# EAGLE design buslamp-r2 (EAGLE 6.4)
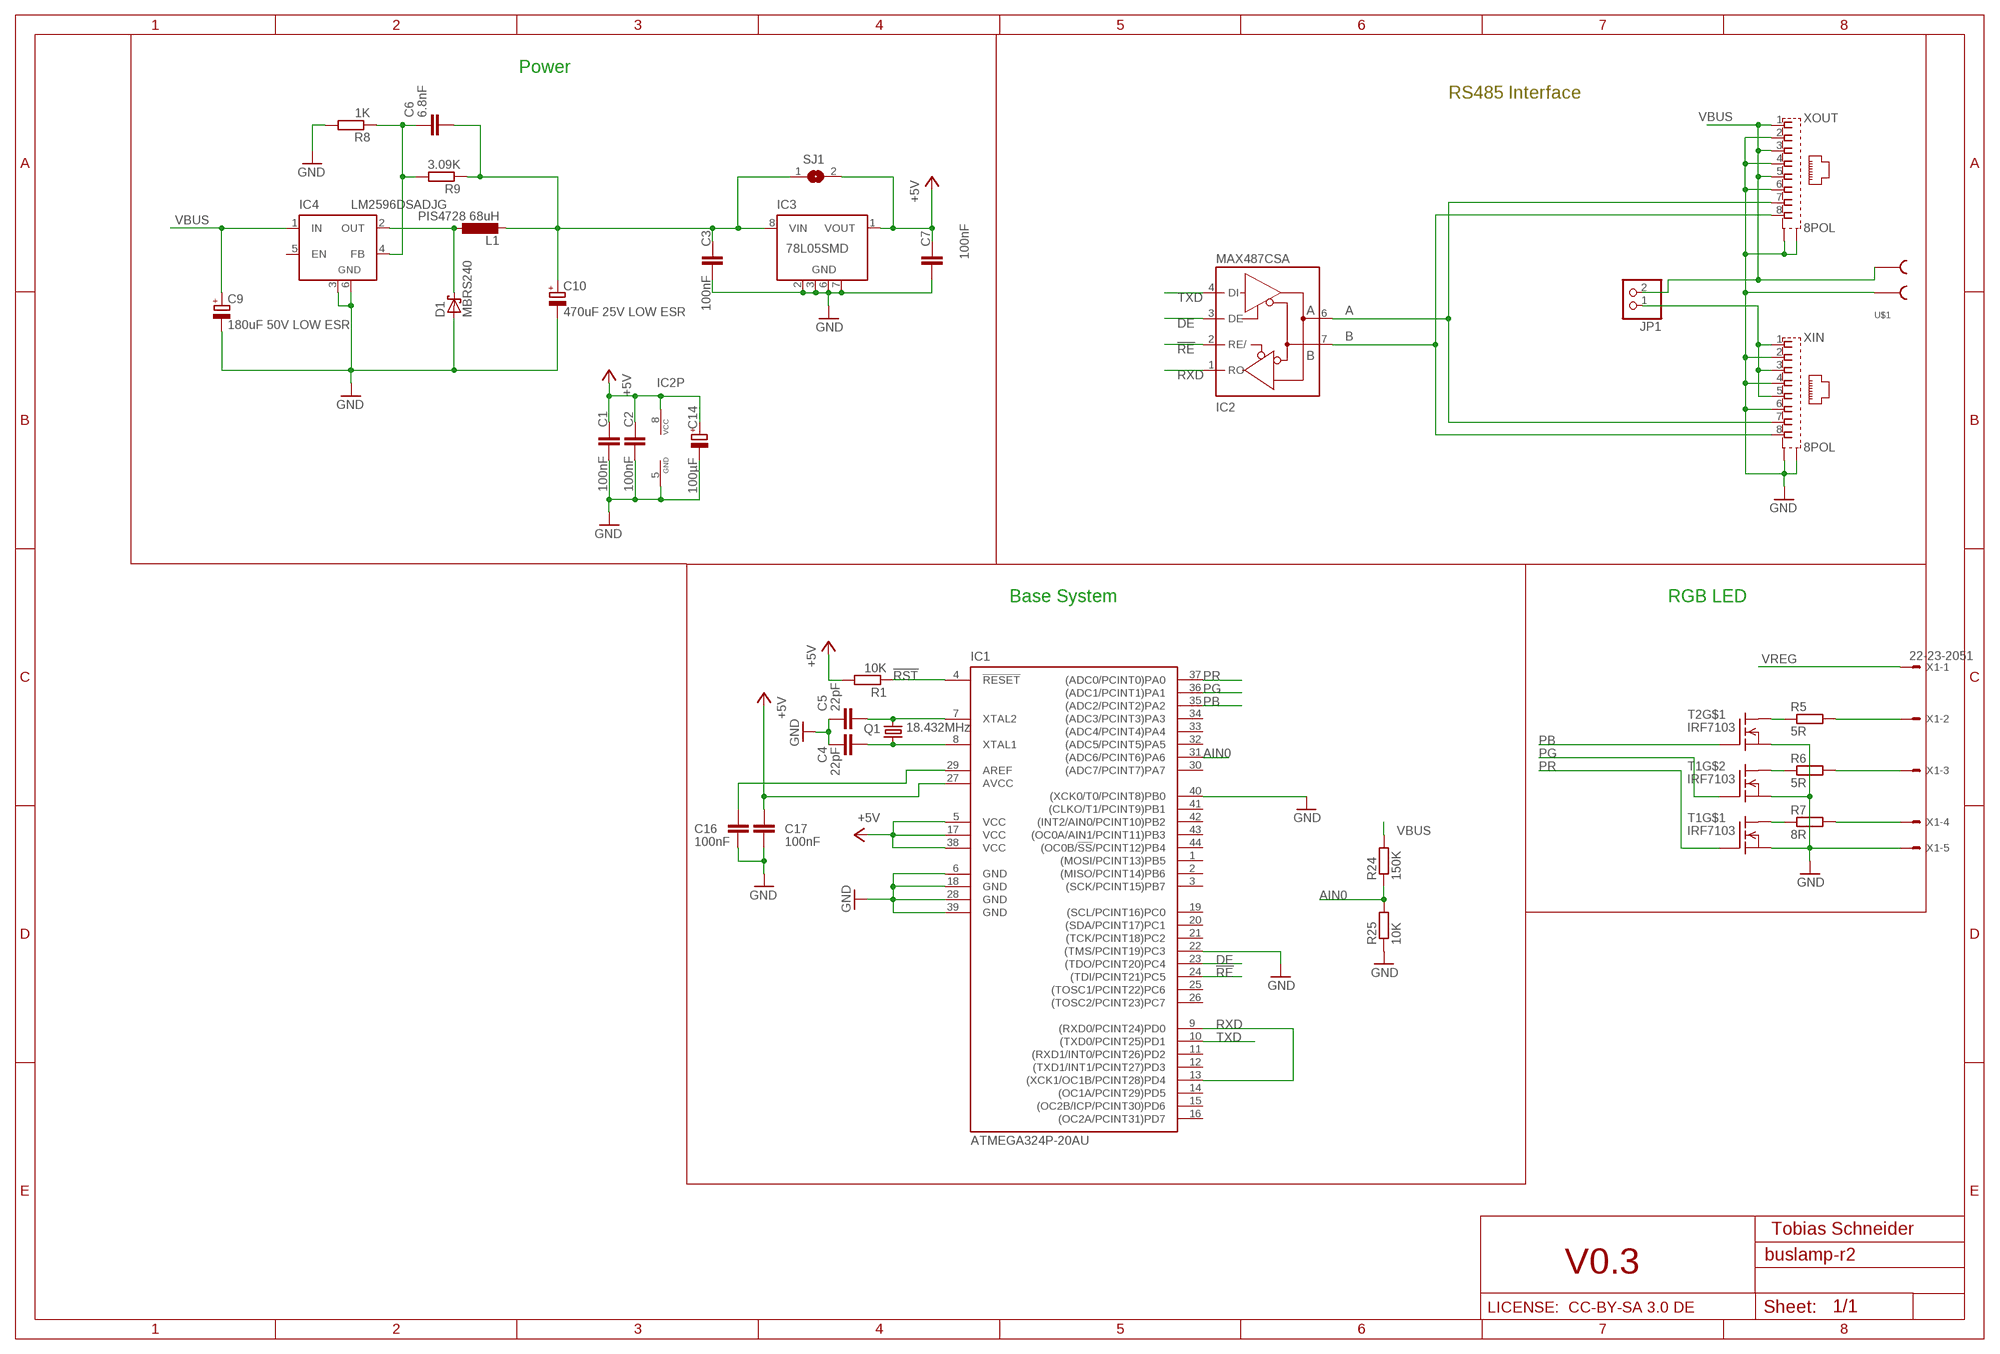
[diagram p0: schematic, sheet 1]

## Parts
C1  100nF  C-EUC0805K  [C0805K]
C2  100nF  C-EUC0805K  [C0805K]
C3  100nF  C-EUC0805K  [C0805K]
C4  22pF  C-EUC0805K  [C0805K]
C5  22pF  C-EUC0805K  [C0805K]
C6  6.8nF  C-EUC0805K  [C0805K]
C7  100nF  C-EUC0805K  [C0805K]
C9  180uF 50V LOW ESR  CPOL-EUE3.5-8  [E3,5-8]
C10  470uF 25V LOW ESR  CPOL-EUE2.5-7  [E2,5-7]
C14  100µF  CPOL-EUE2.5-6  [E2,5-6]
C16  100nF  C-EUC0805  [C0805]
C17  100nF  C-EUC0805  [C0805]
D1  MBRS240  MBRS130LT3  [SMB]
IC1  ATMEGA324P-20AU  MEGA164P/324P/644P-AU  [TQFP44]
IC2  MAX487CSA  MAX481CSA  [SO08]
IC3  78L05SMD  [SO08]
IC4  LM2596DSADJG  LM2596S  [TO263-5]
JP1  PINHD-1X2  [1X02]
L1  PIS4728 68uH  PSI4728  [PIS4728]
Q1  18.432MHz  CRYTALHC49S  [HC49/S]
R1  10K  R-EU_M0805  [M0805]
R5  5R  R-EU_0617/17  [0617/17]
R6  5R  R-EU_0617/17  [0617/17]
R7  8R  R-EU_0617/17  [0617/17]
R8  1K  R-EU_M0805  [M0805]
R9  3.09K  R-EU_M0805  [M0805]
R24  150K  R-EU_R0805  [R0805]
R25  10K  R-EU_R0805  [R0805]
SJ1  SJ  [SJ]
T1  IRF7103  [SO-8]
T2  IRF7103  [SO-8]
U$1  STL-266-2  [STL-266-2]
X1  22-23-2051  [22-23-2051]
XIN  8POL  [8POL]
XOUT  8POL  [8POL]

## Nets
!RE: IC1.24((TDI/PCINT21)PC5) IC2.2(RE/)
!RST: IC1.4(!RESET) R1.1
+5V: C1.1 C2.1 C7.1 C14.+ C17.2 IC1.5(VCC) IC1.17(VCC) IC1.27(AVCC) IC1.38(VCC) IC2.8(VCC) IC3.1(VOUT) R1.2 SJ1.2
A: IC2.6(A) XIN.7 XOUT.7
AIN0: IC1.31((ADC6/PCINT6)PA6) R24.1 R25.2
B: IC2.7(B) XIN.8 XOUT.8
DE: IC1.23((TDO/PCINT20)PC4) IC2.3(DE)
GND: C1.2 C2.2 C3.2 C4.1 C5.1 C7.2 C9.- C10.- C14.- C16.1 C17.1 D1.A IC1.6(GND) IC1.18(GND) IC1.22((TMS/PCINT19)PC3) IC1.28(GND) IC1.39(GND) IC1.40((XCK0/T0/PCINT8)PB0) IC2.5(GND) IC3.2(GND) IC3.3(GND) IC3.6(GND) IC3.7(GND) IC4.3(GND) IC4.6(GND) R8.2 R25.1 T1.1(S) T1.3(S) T2.1(S) U$1.P$3 X1.5 XIN.2 XIN.4 XIN.6 XIN.S1 XIN.S2 XOUT.2 XOUT.4 XOUT.6 XOUT.S1 XOUT.S2
N$1: R7.1 T1.8(D1)
N$3: C6.1 IC4.4(FB) R8.1 R9.2
N$4: R6.1 T1.5(D1)
N$5: R5.1 T2.8(D1)
N$7: R7.2 X1.4
N$8: R6.2 X1.3
N$9: R5.2 X1.2
N$10: D1.C IC4.2(OUT) L1.1
N$29: C16.2 IC1.29(AREF)
PB: IC1.35((ADC2/PCINT2)PA2) T2.2(G)
PG: IC1.36((ADC1/PCINT1)PA1) T1.4(G)
PR: IC1.37((ADC0/PCINT0)PA0) T1.2(G)
RXD: IC1.9((RXD0/PCINT24)PD0) IC1.13((XCK1/OC1B/PCINT28)PD4) IC2.1(RO)
TXD: IC1.10((TXD0/PCINT25)PD1) IC2.4(DI)
VBUS: C9.+ IC4.1(IN) JP1.2 R24.2 U$1.P$4 XOUT.1 XOUT.3 XOUT.5
VBUSOUT: JP1.1 XIN.1 XIN.3 XIN.5
VREG: C3.1 C6.2 C10.+ IC3.8(VIN) L1.2 R9.1 SJ1.1 X1.1
XTAL1: C5.2 IC1.7(XTAL2) Q1.2
XTAL2: C4.2 IC1.8(XTAL1) Q1.1
Unconnected: IC1.1((MOSI/PCINT13)PB5) IC1.2((MISO/PCINT14)PB6) IC1.3((SCK/PCINT15)PB7) IC1.11((RXD1/INT0/PCINT26)PD2) IC1.12((TXD1/INT1/PCINT27)PD3) IC1.14((OC1A/PCINT29)PD5) IC1.15((OC2B/ICP/PCINT30)PD6) IC1.16((OC2A/PCINT31)PD7) IC1.19((SCL/PCINT16)PC0) IC1.20((SDA/PCINT17)PC1) IC1.21((TCK/PCINT18)PC2) IC1.25((TOSC1/PCINT22)PC6) IC1.26((TOSC2/PCINT23)PC7) IC1.30((ADC7/PCINT7)PA7) IC1.32((ADC5/PCINT5)PA5) IC1.33((ADC4/PCINT4)PA4) IC1.34((ADC3/PCINT3)PA3) IC1.41((CLKO/T1/PCINT9)PB1) IC1.42((INT2/AIN0/PCINT10)PB2) IC1.43((OC0A/AIN1/PCINT11)PB3) IC1.44((OC0B/!SS!/PCINT12)PB4) IC3.4(NC) IC3.5(NC) IC4.5(EN) T1.6(D) T1.7(D) T2.3(S) T2.4(G) T2.5(D1) T2.6(D) T2.7(D)

## Notes on the sheet
- Power
- RS485 Interface
- Base System | RGB LED
- Tobias Schneider
- V0.3
- LICENSE:  CC-BY-SA 3.0 DE

## Library data of the parts
C1-C7 C16 C17 = rcl:C-EU: CAPACITOR, European symbol
C9 C10 C14 = rcl:CPOL-EU: POLARIZED CAPACITOR, European symbol
D1 = diode:MBRS130LT3: Schottky Power Rectifier Source: http://www.onsemi.com/pub/Collateral/MBRS130LT3-D.PDF
IC1 = avr-5:MEGA164P/324P/644P-AU
IC2 = maxim:MAX481CSA: RS485 TRANSEIVER
IC3 = linear:78L*SMD: Positive VOLTAGE REGULATOR
IC4 = linear:LM2596S: STEP-DOWN VOLTAGE REGULATOR
JP1 = pinhead:PINHD-1X2: PIN HEADER
L1 = rcl:PSI4728
Q1 = crystal:CRYTAL: CRYSTAL
R1 R8 R9 R24 R25 = rcl:R-EU_: RESISTOR, European symbol
R5-R7 = rclml:R-EU_: RESISTOR, European symbol
SJ1 = jumper:SJ: SMD solder JUMPER
T1 T2 = transistor-fet+irf7201:IRF7103
U$1 = xtort:STL-266-2
X1 = con-molex:22-23-2051: .100" (2.54mm) Center Header - 5 Pin; MF: MOLEX; MPN: 22-23-2051; OC_FARNELL: 1462952; OC_NEWARK: 38C9178
XIN XOUT = con-amp:8POL

## Board
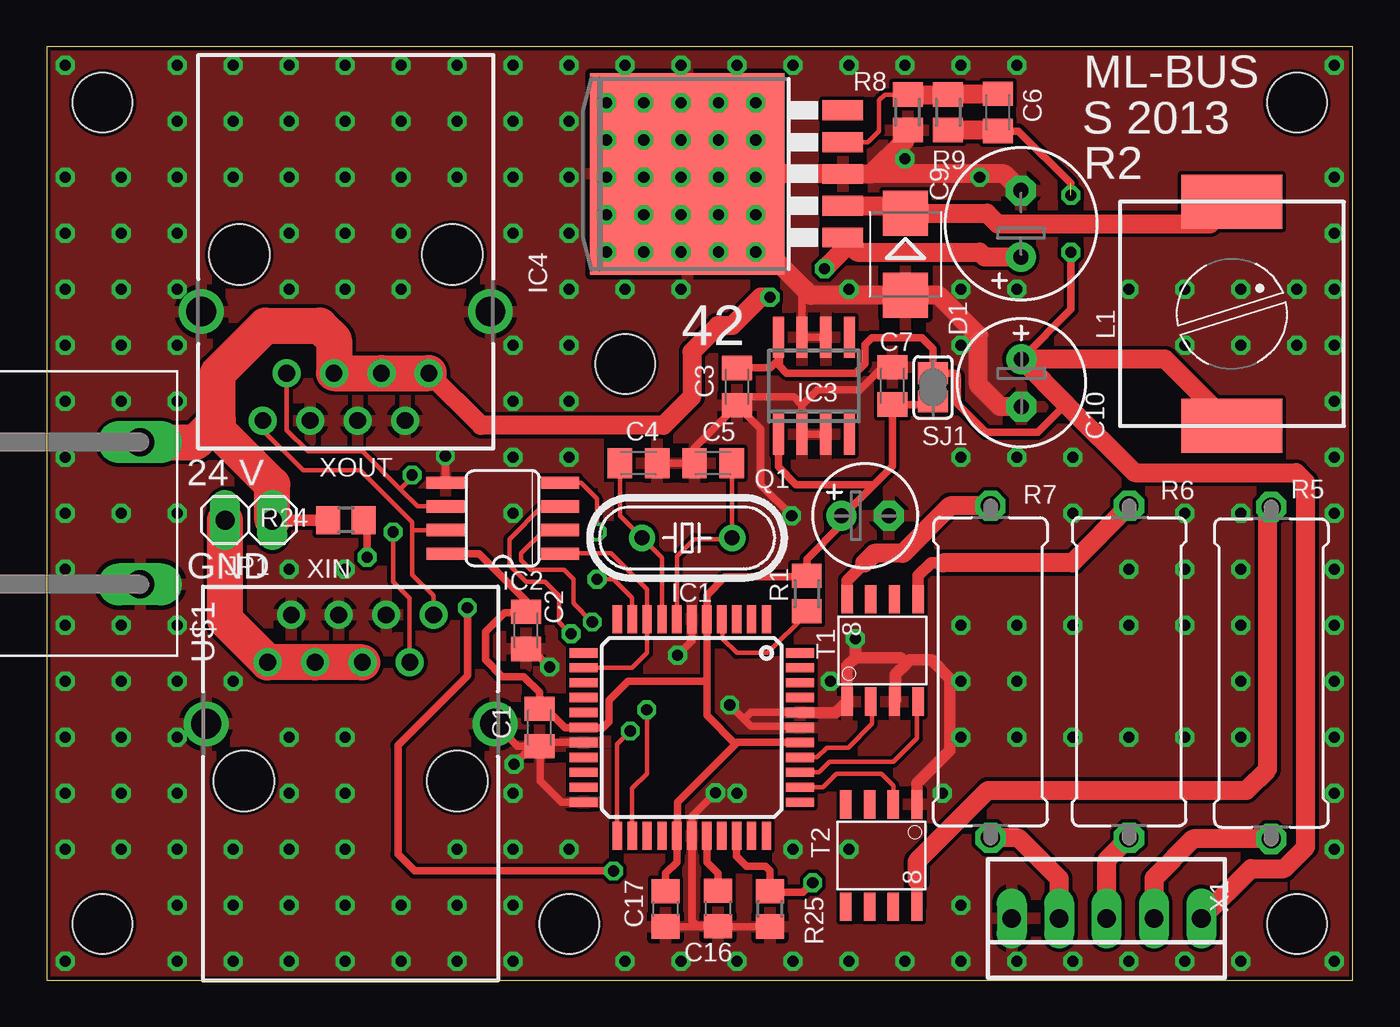
[diagram p1: board, top side]
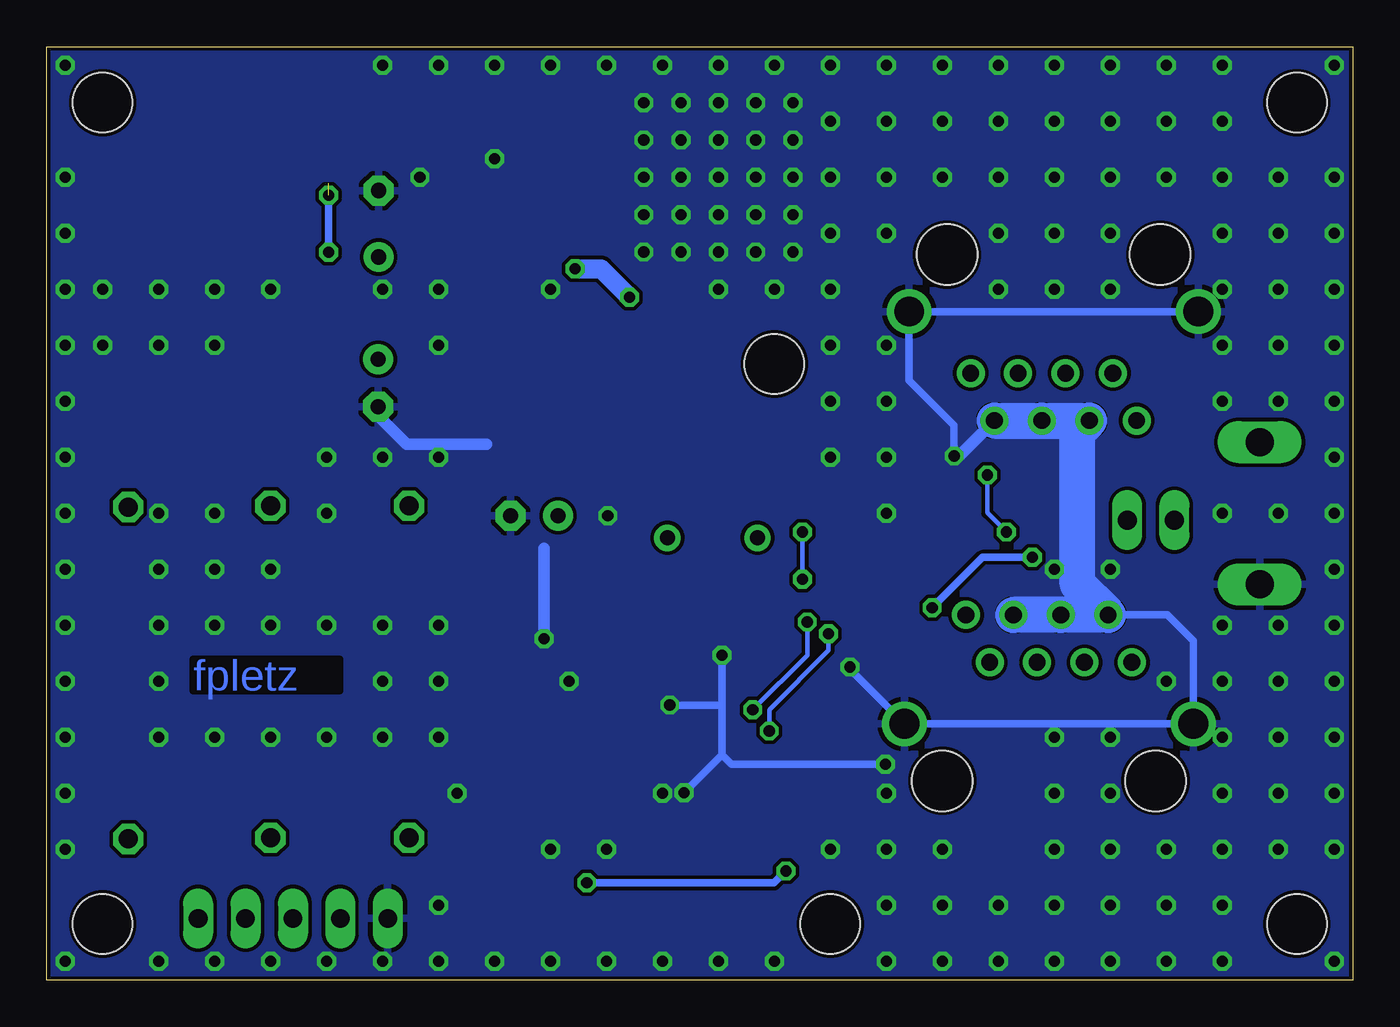
[diagram p2: board, bottom side, seen from below]

Size 70 x 50 mm. Coordinates in mm from the lower left corner, seen from the top.
Outline: 0,0 70,0 70,50 0,50 0,0
Copper layers (1*16): Top 0.035mm / dielectric 1.5mm / Bottom 0.035mm
Design rules "default *": minimum track width 0.2mm, minimum drill 0.5mm, track to track 0.2mm, track to pad 0.2mm, pad to pad 0.2mm, via to via 0.2mm, smd to smd 0mil, copper to edge 0.2mm, drill to drill 8mil, minimum pad ring 0.3mm, minimum via ring 8mil, stop-mask expansion 4mil, vias tented up to drill 0mil, thermal gap 10mil
Holes 3.2 mm at 67,47 67,3 28,3 31,33 3,3 3,47
tRestrict: area 29.7,21 to 29.7,22.4; 3 lines

### Footprints (pad centres in the part's own frame; a part is rotated, then mirrored left to right if it is on the bottom)
C0805K = smd 1.3 x 1.6: 1 -1,0; 2 1,0
E3,5-8 = drill 0.813 pad 1.6: + -1.778,0 | drill 0.813 pad 1.6 octagon: - 1.778,0
E2,5-7 = drill 0.813 pad 1.6: + -1.27,0 | drill 0.813 pad 1.6 octagon: - 1.27,0
E2,5-6 = drill 0.813 pad 1.6: + -1.27,0 | drill 0.813 pad 1.6 octagon: - 1.27,0
C0805 = smd 1.3 x 1.5: 1 -0.95,0; 2 0.95,0
SMB = smd 2.4 x 2.4: A 2.2,0; C -2.2,0
TQFP44 = smd 1.5 x 0.5: 1 -5.8,4; 2 -5.8,3.2; 3 -5.8,2.4; 4 -5.8,1.6; 5 -5.8,0.8; 6 -5.8,0; 7 -5.8,-0.8; 8 -5.8,-1.6; 9 -5.8,-2.4; 10 -5.8,-3.2; 11 -5.8,-4; 23 5.8,-4; 24 5.8,-3.2; 25 5.8,-2.4; 26 5.8,-1.6; 27 5.8,-0.8; 28 5.8,0; 29 5.8,0.8; 30 5.8,1.6; 31 5.8,2.4; 32 5.8,3.2; 33 5.8,4 | smd 0.5 x 1.5: 12 -4,-5.8; 13 -3.2,-5.8; 14 -2.4,-5.8; 15 -1.6,-5.8; 16 -0.8,-5.8; 17 0,-5.8; 18 0.8,-5.8; 19 1.6,-5.8; 20 2.4,-5.8; 21 3.2,-5.8; 22 4,-5.8; 34 4,5.8; 35 3.2,5.8; 36 2.4,5.8; 37 1.6,5.8; 38 0.8,5.8; 39 0,5.8; 40 -0.8,5.8; 41 -1.6,5.8; 42 -2.4,5.8; 43 -3.2,5.8; 44 -4,5.8
SO08 = smd 0.66 x 2.032: 1 -1.905,-3.073; 2 -0.635,-3.073; 3 0.635,-3.073; 4 1.905,-3.073; 5 1.905,3.073; 6 0.635,3.073; 7 -0.635,3.073; 8 -1.905,3.073
SO08' = smd 0.6 x 2.2: 1 -1.905,-2.6; 2 -0.635,-2.6; 3 0.635,-2.6; 4 1.905,-2.6; 5 1.905,2.6; 6 0.635,2.6; 7 -0.635,2.6; 8 -1.905,2.6
TO263-5 = smd 1.067 x 2.159: 1 -3.404,-5.791; 2 -1.702,-5.791; 3 0,-5.791; 4 1.702,-5.791; 5 3.404,-5.791 | smd 10.8 x 10.41: 6 0,2.54
1X02 = drill 1.016 long: 1 -1.27,0; 2 1.27,0
PIS4728 = smd 5.4 x 2.9: 1 0,6; 2 0,-6
HC49/S = drill 0.813: 1 -2.413,0; 2 2.413,0
M0805 = smd 1.3 x 1.6: 1 -0.95,0; 2 0.95,0
0617/17 = drill 1.016 octagon: 1 -8.89,0; 2 8.89,0
R0805 = smd 1.3 x 1.5: 1 -0.95,0; 2 0.95,0
SJ = smd 1.168 x 1.6: 1 -0.762,0; 2 0.762,0
SO-8 = smd 1.524 x 0.61: 1 -2.743,1.27; 2 -2.743,0; 3 -2.743,-1.27; 4 -2.743,-2.54; 5 2.743,-2.54; 6 2.743,-1.27; 7 2.743,0; 8 2.743,1.27
STL-266-2 = drill 1.5 long: P$3 -3.81,-4; P$4 3.81,-4
22-23-2051 = drill 1 long: 1 -5.08,0; 2 -2.54,0; 3 0,0; 4 2.54,0; 5 5.08,0
8POL = drill 0.9: 1 -4.445,6.35; 2 -3.175,8.89; 3 -1.905,6.35; 4 -0.635,8.89; 5 0.635,6.35; 6 1.905,8.89; 7 3.175,6.35; 8 4.445,8.89 | drill 1.6: S1 -7.745,3.05; S2 7.745,3.05 | hole 3.25: -5.715,0; 5.715,0

### Placement (x,y rotation side)
C1  26.41,13.53 270 top
C2  25.68,18.73 270 top
C3  36.99,31.79 270 top
C4  31.72,27.69 180 top
C5  35.72,27.69 0 top
C6  50.97,46.48 270 top
C7  45.32,31.83 90 top
C9  52.21,40.51 90 top
C10  52.23,31.99 270 top
C14  43.87,24.87 0 top
C16  35.99,3.83 90 top
C17  33.18,3.81 90 top
D1  46.02,38.88 270 top
IC1  34.58,13.53 270 top
IC2  24.44,24.74 90 top
IC3  78L05SMD  [SO08']  41.12,31.83 0 top
IC4  36.88,43.18 90 top
JP1  10.83,24.64 0 top
L1  63.52,35.69 0 top
Q1  34.32,23.69 0 top
R1  40.73,20.7 90 top
R5  65.63,16.45 270 top
R6  58.01,16.51 270 top
R7  50.58,16.51 270 top
R8  46.15,46.48 270 top
R9  48.31,46.48 90 top
R24  16.03,24.64 180 top
R25  38.77,3.81 90 top
SJ1  47.5,31.75 270 top
T1  44.16,17.65 90 top
T2  45.37,6.67 270 top
U$1  1,25 90 top
X1  56.8,3.3 180 top
XIN  16.29,10.67 0 top
XOUT  16.03,38.86 180 top

### Tracks (layer width: path | path; a pad name or v marks a point on that pad's centre or on a via)
!RE  (via drill 0.6)
  Top 0.254: IC2.2 26.67,24.1 25.43,22.86 25.43,22.48 25.94,21.97 27.72,21.97 28.23,21.46 28.23,20.19 v29.24,19.18 | v32.16,14.48 32.16,11.05 31.38,10.26 IC1.24
  Bottom 0.254: v29.24,19.18 29.24,17.4 v32.16,14.48
!RST
  Top 0.254: R1.1 40.73,19.62 38.64,17.53 36.99,17.53 36.23,18.29 36.23,19.27 IC1.4
+5V
  Top 0.406: IC1.38 37.01,12.73 36.92,12.64 | 36.92,12.64 33.81,9.53 33.81,7.76 IC1.27 33.77,6.31 33.18,5.71 C17.2 | 36.92,12.64 35.38,14.19 35.38,15.88 | 35.38,15.88 IC1.5 35.38,20.61 36.35,21.59 40.67,21.59 R1.2 40.73,22.54 42.6,24.41 C14.+ 42.68,24.87 44.29,26.48 | 44.29,26.48 44.23,26.54 40.16,26.54 39.21,27.5 IC3.1 | 44.29,26.48 45.32,27.51 C7.1 47.34,30.83 SJ1.2 | 35.38,15.88 35.25,16 31.15,16 30.13,14.99 30.13,13.84 29.81,13.53 IC1.17 27.78,13.53 26.95,14.35 26.58,14.35 C1.1 26.41,15.41 25.56,16.26 24.41,16.26 23.53,17.14 23.53,18.67 24.54,19.68 25.64,19.68 C2.1 25.68,20.32 23.17,22.83 IC2.8
A  (via drill 0.6)
  Top 0.254: XOUT.7 12.86,29.46 14,28.32 16.92,28.32 18.95,26.29 | IC2.6 19.87,25.37 18.95,26.29 | XIN.7 19.46,20.45 18.57,21.34 v18.57,24 | 18.95,26.29 19.59,26.92 v19.59,27.05
  Bottom 0.254: v18.57,24 19.59,25.02 v19.59,27.05
AIN0  (via drill 0.6)
  Top 0.406: IC1.31 36.98,6.62 37.5,6.1 38.51,6.1 38.77,5.84 R25.2 38.83,4.7 40.54,4.7 v41.05,5.21 | R24.1 17.18,24.45 v17.18,22.64 | v30.38,5.84 19.72,5.84 18.83,6.73 18.83,12.57 22.55,16.29 v22.55,19.94
  Bottom 0.406: v41.05,5.21 31.02,5.21 v30.38,5.84 | v17.18,22.64 19.84,22.64 v22.55,19.94
B
  Top 0.254: XOUT.8 11.59,29.46 13.75,27.3 16.8,27.3 19.59,24.51 19.59,24.07 | IC2.7 19.62,24.1 19.59,24.07 | XIN.8 20.73,20.57 19.59,21.72 19.59,24.07
DE  (via drill 0.6)
  Top 0.254: IC2.3 26.54,25.37 24.8,23.62 24.8,22.23 25.68,21.34 26.7,21.34 27.46,20.57 27.46,19.18 v28.1,18.54 27.84,18.8 | v31.27,13.34 30.57,12.64 IC1.23
  Bottom 0.254: v28.1,18.54 28.1,17.65 31.27,14.48 v31.27,13.34
GND  (via drill 0.6)
  Top 0.406: C16.1 35.94,2.92 34.83,2.92 34.58,3.17 IC1.28 34.58,8.76 v35.84,10.03 | R25.1 36,2.86 C16.1 | C17.1 35.97,2.86 C16.1 | 41.69,34.49 IC3.6 IC3.7 40.48,36.77 40.67,36.96 | IC3.3 IC3.2 40.48,30.8 | 40.48,30.8 40.04,31.24 37.45,31.24 C3.2 | IC2.5 v21.37,28.06 v21.37,28.07 | C4.1 C5.1 34.72,28.51 C3.2 | C7.2 44.8,32.83 43.59,31.62 41.31,31.62 40.48,30.8 | v39.93,24.87 38.26,26.54 38.26,29.53 C3.2 | IC1.6 34.58,18.16 v33.81,17.4 | IC1.39 40.31,13.59 37.75,13.59 37.37,13.97 | IC1.40 40.35,14.35 37.75,14.35 37.37,13.97 | 37.37,13.97 v36.61,14.73 | IC1.22 27.59,9.53 26.45,10.67 26.45,12.49 C1.2 | IC1.18 26.61,12.73 C1.2 | C1.2 26.02,12.53 | 26.02,12.53 v25.05,11.56 | 26.02,12.53 25.22,12.53 XIN.S2 | C2.2 25.99,17.73 v26.95,16.76
  Top 0.61: T2.1 46.64,10.54 48.42,12.32 48.42,16.13 47.4,17.14 46.26,17.14 46.07,16.95 | 46.07,16.95 45.5,16.38 45.5,14.97 T1.3 | 43.34,17.27 42.89,16.83 T1.1 42.31,14.32 IC1.40 | 43.34,17.27 45.75,17.27 46.07,16.95 | 43.34,17.27 v43.34,18.29
  Top 1.016: 44.18,43.18 IC4.3 35.18,43.18 34.76,42.76 | 44.18,43.18 46,45 46,45.38 R8.2 | C9.- 51.32,43.18 44.18,43.18 | 34.76,42.76 IC4.6 | C10.- 51.1,30.72 49.94,31.88 49.94,34.54 47.81,36.68 D1.A 40.95,36.68 40.67,36.96 36.47,41.16 36.36,41.16 | 36.48,41.04 36.36,41.16 | 36.36,41.16 34.76,42.76
  Bottom 0.406: XOUT.S2 XOUT.S1 23.78,32.13 21.37,29.72 v21.37,28.07 | v33.81,17.4 33.81,14.73 | 33.81,14.73 33.81,12.06 | 33.81,12.06 v35.84,10.03 | v36.61,14.73 33.81,14.73 | v25.05,11.56 33.3,11.56 33.81,12.06 | v26.95,16.76 26.95,16.64 XIN.S2 XIN.S1 8.54,18.16 9.94,19.56 XIN.2
  Bottom 0.61: v43.34,18.29 43.34,23.13 | 46.43,28.7 50.7,28.7 52.23,30.23 C10.- | XOUT.2 21.11,28.07 v21.37,28.07
  Bottom 1.93: XIN.6 XIN.4 XIN.2 14.76,21.21 14.76,29.34 XOUT.6 XOUT.4 XOUT.2
  other vias: 7,40 7,46 7,49 7,43 7,37 7,34 7,31 7,25 7,19 7,16 7,13 7,10 7,7 7,4 7,1 13,49 10,49 16,49 19,49 22,49 25,49 28,49 31,49 34,49 37,49 40,49 43,49 46,49 49,49 52,49 13,1 10,1 16,1 19,1 22,1 25,1 31,1 34,1 37,1 40,1 43,1 46,1 49,1 52,1 55,1 58,1 69,49 69,43 69,40 69,37 69,34 69,31 69,28 69,25 69,22 69,19 69,16 69,13 69,10 69,7 69,1 61,1 64,1 13,4 10,4 10,7 13,7 16,7 16,4 19,4 22,4 25,4 16,10 13,10 13,13 16,13 10,16 22,7 25,7 28,7 25,10 43,7 40,7 37,10 64,13 61,13 58,13 55,13 52,13 49,13 49,16 48,10 52,16 64,16 64,19 61,19 58,19 55,19 52,19 49,19 58,22 61,22 64,22 64,25 61,25 42,16 49,4 10,46 13,46 16,46 19,46 22,46 25,46 28,46 28,43 28,40 28,37 25,43 25,40 22,43 19,43 16,43 13,43 10,43 13,40 16,40 19,40 19,37 16,37 13,37 28,34 25,34 25,31 28,31 25,28 28,28 25,25 30,47 30,45 30,43 30,41 30,39 32,39 32,41 32,43 32,45 32,47 34,47 34,45 34,43 34,41 34,39 36,47 36,45 36,43 36,41 36,39 38,47 38,45 38,43 38,41 38,39 31,37 34,37 58,37 61,37 64,37 64,34 61,34 67,34 67,37 50,43 46,44 52,37 49,37 49,34 43,37 55,28 55,25 52,28 49,28 4,19 4,16 4,13 4,10 4,7 4,25 4,31 4,34 4,37 4,40 4,43 1,1 1,7 1,10 1,13 1,16 1,19 1,22 1,25 1,34 1,31 1,28 1,37 1,40 1,43 1,49 13,22 16,22
  pour Bottom: -1,51 71,51 71,-1 -1,0
  pour Top: -1,51 71,51 71,-1 -1,0
N$1
  Top 0.61: 43.85,22.35 42.89,21.4 T1.8
  Top 1.016: R7.1 48.42,25.4 45.88,22.86 44.35,22.86 43.85,22.35
N$3
  Top 0.254: IC4.4 44.02,44.88 44.61,45.47 44.61,47.12 44.92,47.43 R8.1
  Top 1.016: R8.1 R9.2 48.36,47.48 C6.1
N$4
  Top 0.61: 48.04,22.35 47.4,22.35 46.7,21.65 T1.5
  Top 1.016: 48.04,22.35 54.96,22.35 R6.1
N$5
  Top 0.61: 46.64,5.33 T2.8
  Top 1.016: 46.64,5.33 46.64,6.35 50.45,10.16 64.29,10.16 65.44,11.3 65.44,25.15 R5.1
N$7
  Top 1.016: X1.4 54.26,5.43 52.07,7.62 R7.2
N$8
  Top 1.016: X1.3 56.8,6.41 R6.2
N$9
  Top 1.016: R5.2 61.44,7.56 59.34,5.46 X1.2
N$10
  Top 1.016: IC4.2 45.62,41.48 D1.C 50.39,41.08 50.96,40.51 62.34,40.51 L1.1
N$29
  Top 0.406: IC1.29 35.38,6.31 35.97,5.71 35.97,4.79 C16.2
PB
  Top 0.254: IC1.35 41.6,10.32 42.32,11.05 44.73,11.05 45.37,10.41 T2.2
PG
  Top 0.254: IC1.36 41.38,11.13 41.94,11.68 45.37,11.68 46.64,12.95 46.64,14.85 T1.4
PR
  Top 0.254: IC1.37 41.29,11.93 41.81,12.45 42.96,12.45 44.23,13.72 44.23,14.85 T1.2
RXD
  Top 0.254: IC2.1 27.55,22.86 30.26,22.86 32.17,20.94 IC1.9 32.17,17.54 31.36,16.73 IC1.13
TXD  (via drill 0.6)
  Top 0.254: IC2.4 28.64,26.64 29.5,25.78 v29.5,24 | v29.5,21.46 30.38,21.46 31.38,20.47 IC1.10
  Bottom 0.254: v29.5,24 v29.5,21.46
VBUS  (via drill 0.6)
  Top 0.61: JP1.2 R24.2
  Top 1.016: C9.+ 50.27,38.73 50,39 43.45,39 IC4.1 42.67,39.08 v41.69,38.1 | v38.77,36.58 38.26,36.58 36.73,35.05 35.97,35.05 34.58,33.66 34.58,31.24 33.05,29.72 23.27,29.72 XOUT.1
  Top 1.93: JP1.2 12.1,26.54 9.18,29.46 9.18,30 | 9.18,30 9.18,32.51 11.71,35.05 14.64,35.05 15.4,34.29 XOUT.5 XOUT.3 XOUT.1 | U$1.P$4 7.99,28.81 9.18,30
  Bottom 1.016: v41.69,38.1 40.29,38.1 v38.77,36.58
VBUSOUT
  Top 1.93: XIN.5 XIN.3 XIN.1 9.56,19.3 JP1.1
VREG  (via drill 0.6)  (1 unrouted)
  Top 0.406: C6.2 52.09,45.48 54.9,42.67 | v54.9,38.99 54.9,35.92 C10.+ | C3.1 38.79,32.79 39.27,33.27 | 39.27,33.27 39.27,34.37 IC3.8 | 54.63,30.85 53.12,29.34 50.32,29.34 48.8,30.86 48.8,32.38 48.67,32.51 SJ1.1 47.5,33.81 46.89,34.42 44.23,34.42 43.85,34.04 43.85,33.02 43.34,32.51 39.66,32.51 39.27,32.89 39.27,33.27
  Top 1.016: C6.2 50.92,45.53 R9.1 | L1.2 59.94,33.26 C10.+ 54.63,30.85 58.31,27.18 66.96,27.18 67.47,26.67 67.47,7.11 66.33,5.97 64.55,5.97 X1.1
  Bottom 0.406: v54.9,42.04 v54.9,38.99
XTAL1
  Top 0.254: C5.2 36.72,23.7 Q1.2 36.67,23.62 34.7,23.62 33.77,22.7 IC1.7
XTAL2
  Top 0.254: C4.2 30.72,24.88 Q1.1 32.98,22.62 IC1.8

### Text on the board
Bottom: fpletz
tPlace: ML-BUS | S 2013 | R2 | 42 | 24 V | GND